# EAGLE design LCDClock (EAGLE 8.1.0)

## Sheet 1 of 2
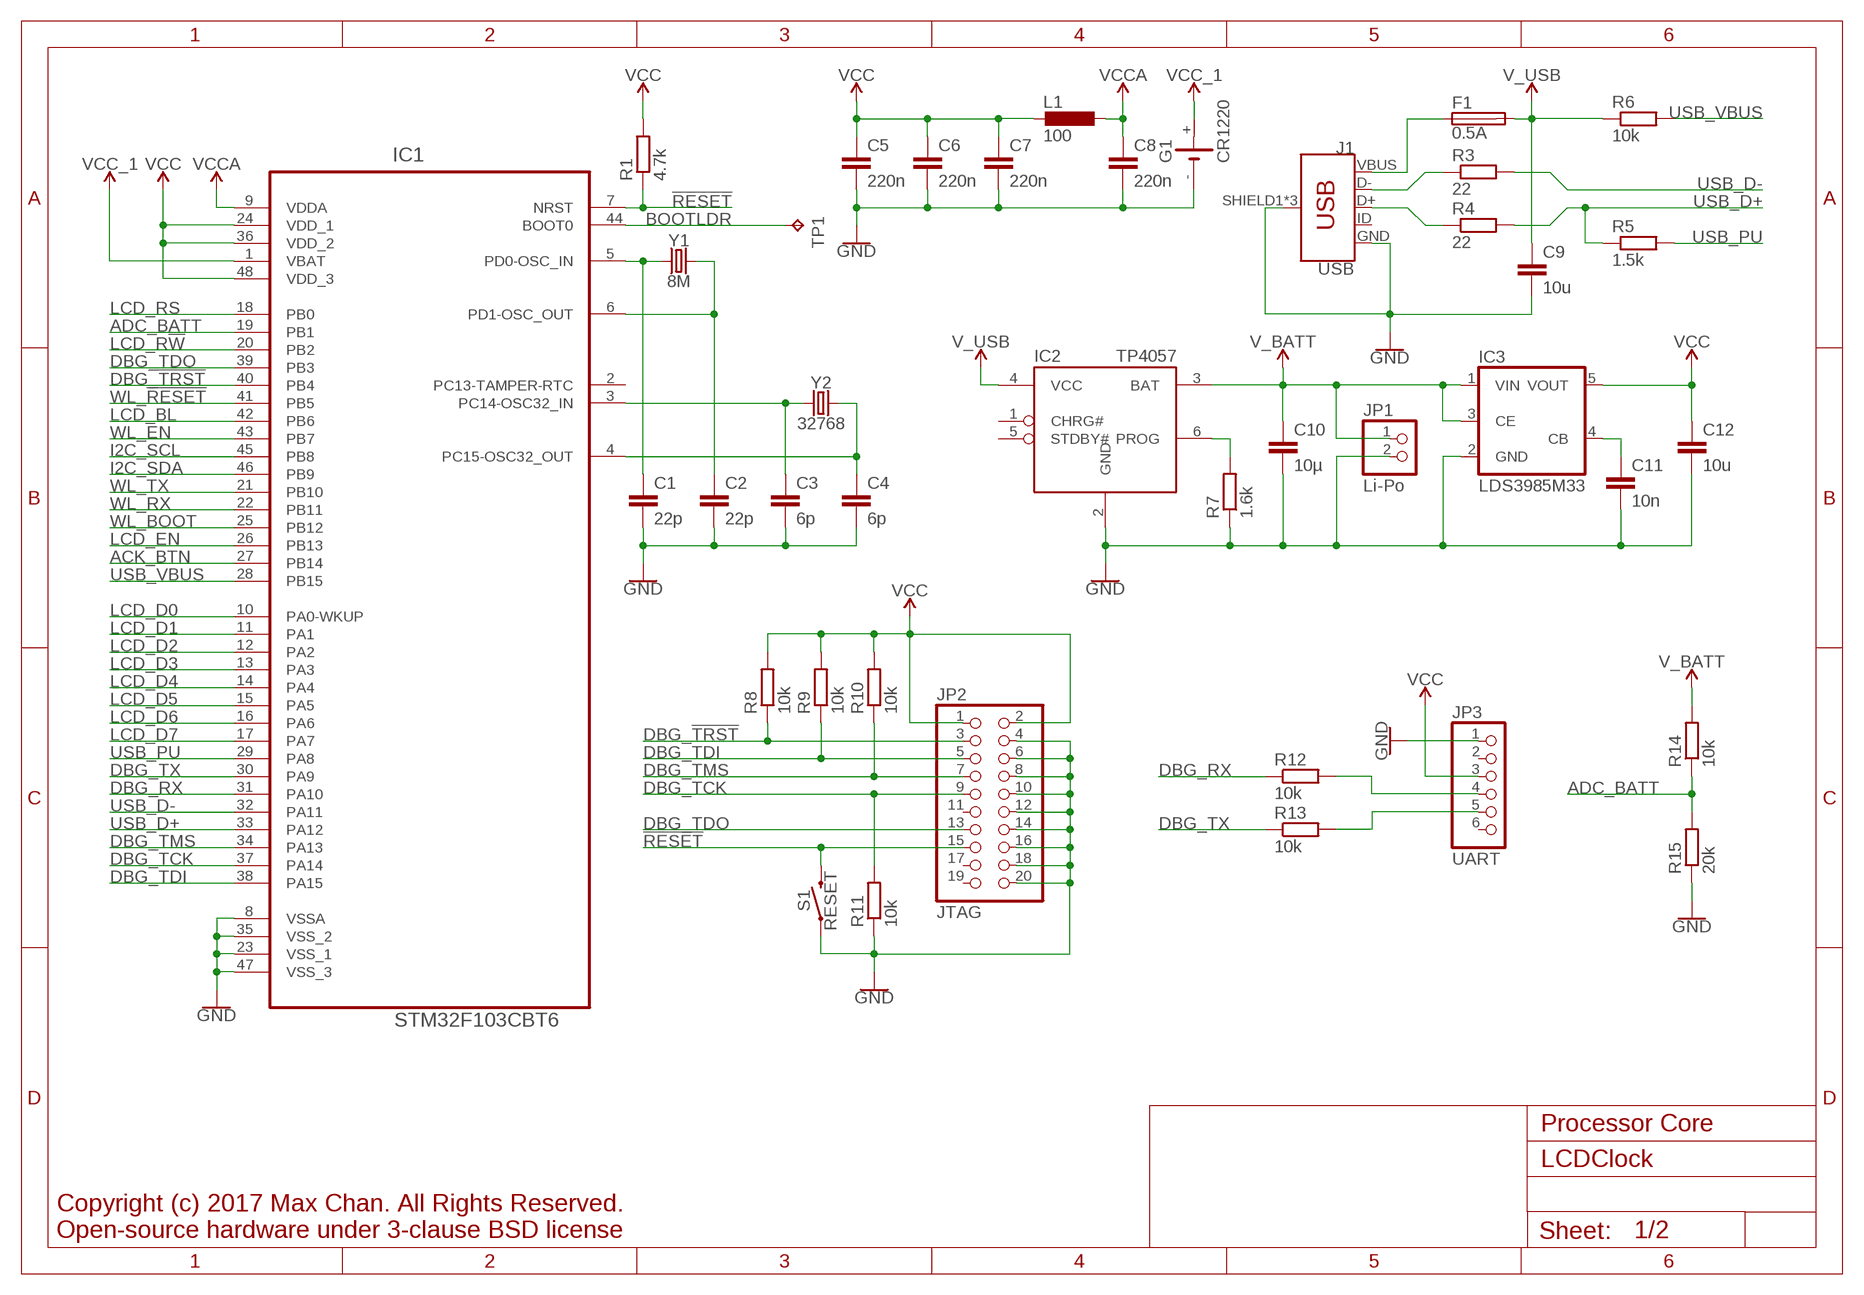
[diagram p0: schematic, sheet 1]

### Parts
C1  22p  C-EUC0603  [C0603]
C2  22p  C-EUC0603  [C0603]
C3  6p  C-EUC0603  [C0603]
C4  6p  C-EUC0603  [C0603]
C5  220n  C-EUC0603  [C0603]
C6  220n  C-EUC0603  [C0603]
C7  220n  C-EUC0603  [C0603]
C8  220n  C-EUC0603  [C0603]
C9  10u  C-EUC0805  [C0805]
C10  10µ  C-EUC0805  [C0805]
C11  10n  C-EUC0603  [C0603]
C12  10u  C-EUC0805  [C0805]
F1  0.5A  FUSER1206  [R1206]
G1  CR1220  CH291-1220LF  [CH291-1220LF]
IC1  STM32F103CBT6  [QFP50P900X900X160-48N]
IC2  TP4057  [SOT23-6]
IC3  LDS3985M33  TS520533  [SOT25]
J1  USB  USB_MICRO-B_FEMALE-SMT  [USB-B-MICRO-SMD]
JP1  Li-Po  PINHD-1X2  [1X02]
JP2  JTAG  PINHD-2X10/90  [2X10/90]
JP3  UART  PINHD-1X6/90  [1X06/90]
L1  100  L-EUL2012C  [L2012C]
R1  4.7k  R-EU_R0603  [R0603]
R3  22  R-EU_R0603  [R0603]
R4  22  R-EU_R0603  [R0603]
R5  1.5k  R-EU_R0603  [R0603]
R6  10k  R-EU_R0603  [R0603]
R7  1.6k  R-EU_R0603  [R0603]
R8  10k  R-EU_R0603  [R0603]
R9  10k  R-EU_R0603  [R0603]
R10  10k  R-EU_R0603  [R0603]
R11  10k  R-EU_R0603  [R0603]
R12  10k  R-EU_R0603  [R0603]
R13  10k  R-EU_R0603  [R0603]
R14  10k  R-EU_R0603  [R0603]
R15  20k  R-EU_R0603  [R0603]
S1  RESET  MOMENTARY-SWITCH-SPST-SMD-6.0X3.5MM  [TACTILE_SWITCH_SMD_6.0X3.5MM]
TP1  TPTP10R  [TP10R]
Y1  8M  CRYSTALSMD-5X3.2-4PAD  [CRYSTAL-SMD-5X3.2-4PAD]
Y2  32768  CRYSTALSMD-3.2X1.5  [CRYSTAL-SMD-3.2X1.5MM]

### Nets
!RESET: IC1.7(NRST) JP2.15 R1.1 S1.2
ACK_BTN: IC1.27(PB14) ; also sheet 2
ADC_BATT: IC1.19(PB1) R14.1 R15.2
BATT_PROG: IC2.6(PROG) R7.2
BOOTLDR: IC1.44(BOOT0) TP1.TP
DBG_!TRST: IC1.40(PB4) JP2.3 R8.1
DBG_RX: IC1.31(PA10) R12.1
DBG_TCK: IC1.37(PA14) JP2.9 R11.2
DBG_TDI: IC1.38(PA15) JP2.5 R9.1
DBG_TDO: IC1.39(PB3) JP2.13
DBG_TMS: IC1.34(PA13) JP2.7 R10.1
DBG_TX: IC1.30(PA9) R13.1
DBGRX: JP3.4 R12.2
DBGTX: JP3.5 R13.2
GND: C1.2 C2.2 C3.2 C4.2 C5.2 C6.2 C7.2 C8.2 C9.2 C10.2 C11.2 C12.2 G1.- IC1.8(VSSA) IC1.23(VSS_1) IC1.35(VSS_2) IC1.47(VSS_3) IC2.2(GND) IC3.2(GND) J1.GND J1.SHIELD1(SHIELD) J1.SHIELD2(SHIELD) J1.SHIELD3(SHIELD) JP1.2 JP2.4 JP2.6 JP2.8 JP2.10 JP2.12 JP2.14 JP2.16 JP2.18 JP2.20 JP3.1 R7.1 R11.1 R15.1 S1.1 ; also sheet 2
HSE_IN: C1.1 IC1.5(PD0-OSC_IN) Y1.1
HSE_OUT: C2.1 IC1.6(PD1-OSC_OUT) Y1.3
I2C_SCL: IC1.45(PB8) ; also sheet 2
I2C_SDA: IC1.46(PB9) ; also sheet 2
LCD_BL: IC1.42(PB6) ; also sheet 2
LCD_D0: IC1.10(PA0-WKUP) ; also sheet 2
LCD_D1: IC1.11(PA1) ; also sheet 2
LCD_D2: IC1.12(PA2) ; also sheet 2
LCD_D3: IC1.13(PA3) ; also sheet 2
LCD_D4: IC1.14(PA4) ; also sheet 2
LCD_D5: IC1.15(PA5) ; also sheet 2
LCD_D6: IC1.16(PA6) ; also sheet 2
LCD_D7: IC1.17(PA7) ; also sheet 2
LCD_EN: IC1.26(PB13) ; also sheet 2
LCD_R!W: IC1.20(PB2) ; also sheet 2
LCD_RS: IC1.18(PB0) ; also sheet 2
LSE_IN: C3.1 IC1.3(PC14-OSC32_IN) Y2.P$1
LSE_OUT: C4.1 IC1.4(PC15-OSC32_OUT) Y2.P$2
UD+: J1.D+ R4.1
UD-: J1.D- R3.1
USB_D+: IC1.33(PA12) R4.2 R5.1
USB_D-: IC1.32(PA11) R3.2
USB_PU: IC1.29(PA8) R5.2
USB_VBUS: IC1.28(PB15) R6.2
V_BATT: C10.1 IC2.3(BAT) IC3.1(VIN) IC3.3(CE) JP1.1 R14.2 ; also sheet 2
V_USB: C9.1 F1.2 IC2.4(VCC) R6.1
VBUS: F1.1 J1.VBUS
VCC: C5.1 C6.1 C7.1 C12.1 IC1.24(VDD_1) IC1.36(VDD_2) IC1.48(VDD_3) IC3.5(VOUT) JP2.1 JP2.2 JP3.3 L1.2 R1.2 R8.2 R9.2 R10.2 ; also sheet 2
VCC_1: G1.+ IC1.1(VBAT)
VCC_FILT: C11.1 IC3.4(CB)
VCCA: C8.1 IC1.9(VDDA) L1.1
WL_!RESET: IC1.41(PB5) ; also sheet 2
WL_BOOT: IC1.25(PB12) ; also sheet 2
WL_EN: IC1.43(PB7) ; also sheet 2
WL_RX: IC1.22(PB11) ; also sheet 2
WL_TX: IC1.21(PB10) ; also sheet 2
Unconnected: IC1.2(PC13-TAMPER-RTC) IC2.1(CHRG#) IC2.5(STDBY#) J1.ID JP2.11 JP2.17 JP2.19 JP3.2 JP3.6

### Notes on the sheet
- Processor Core
- Copyright (c) 2017 Max Chan. All Rights Reserved.
  Open-source hardware under 3-clause BSD license

## Sheet 2 of 2
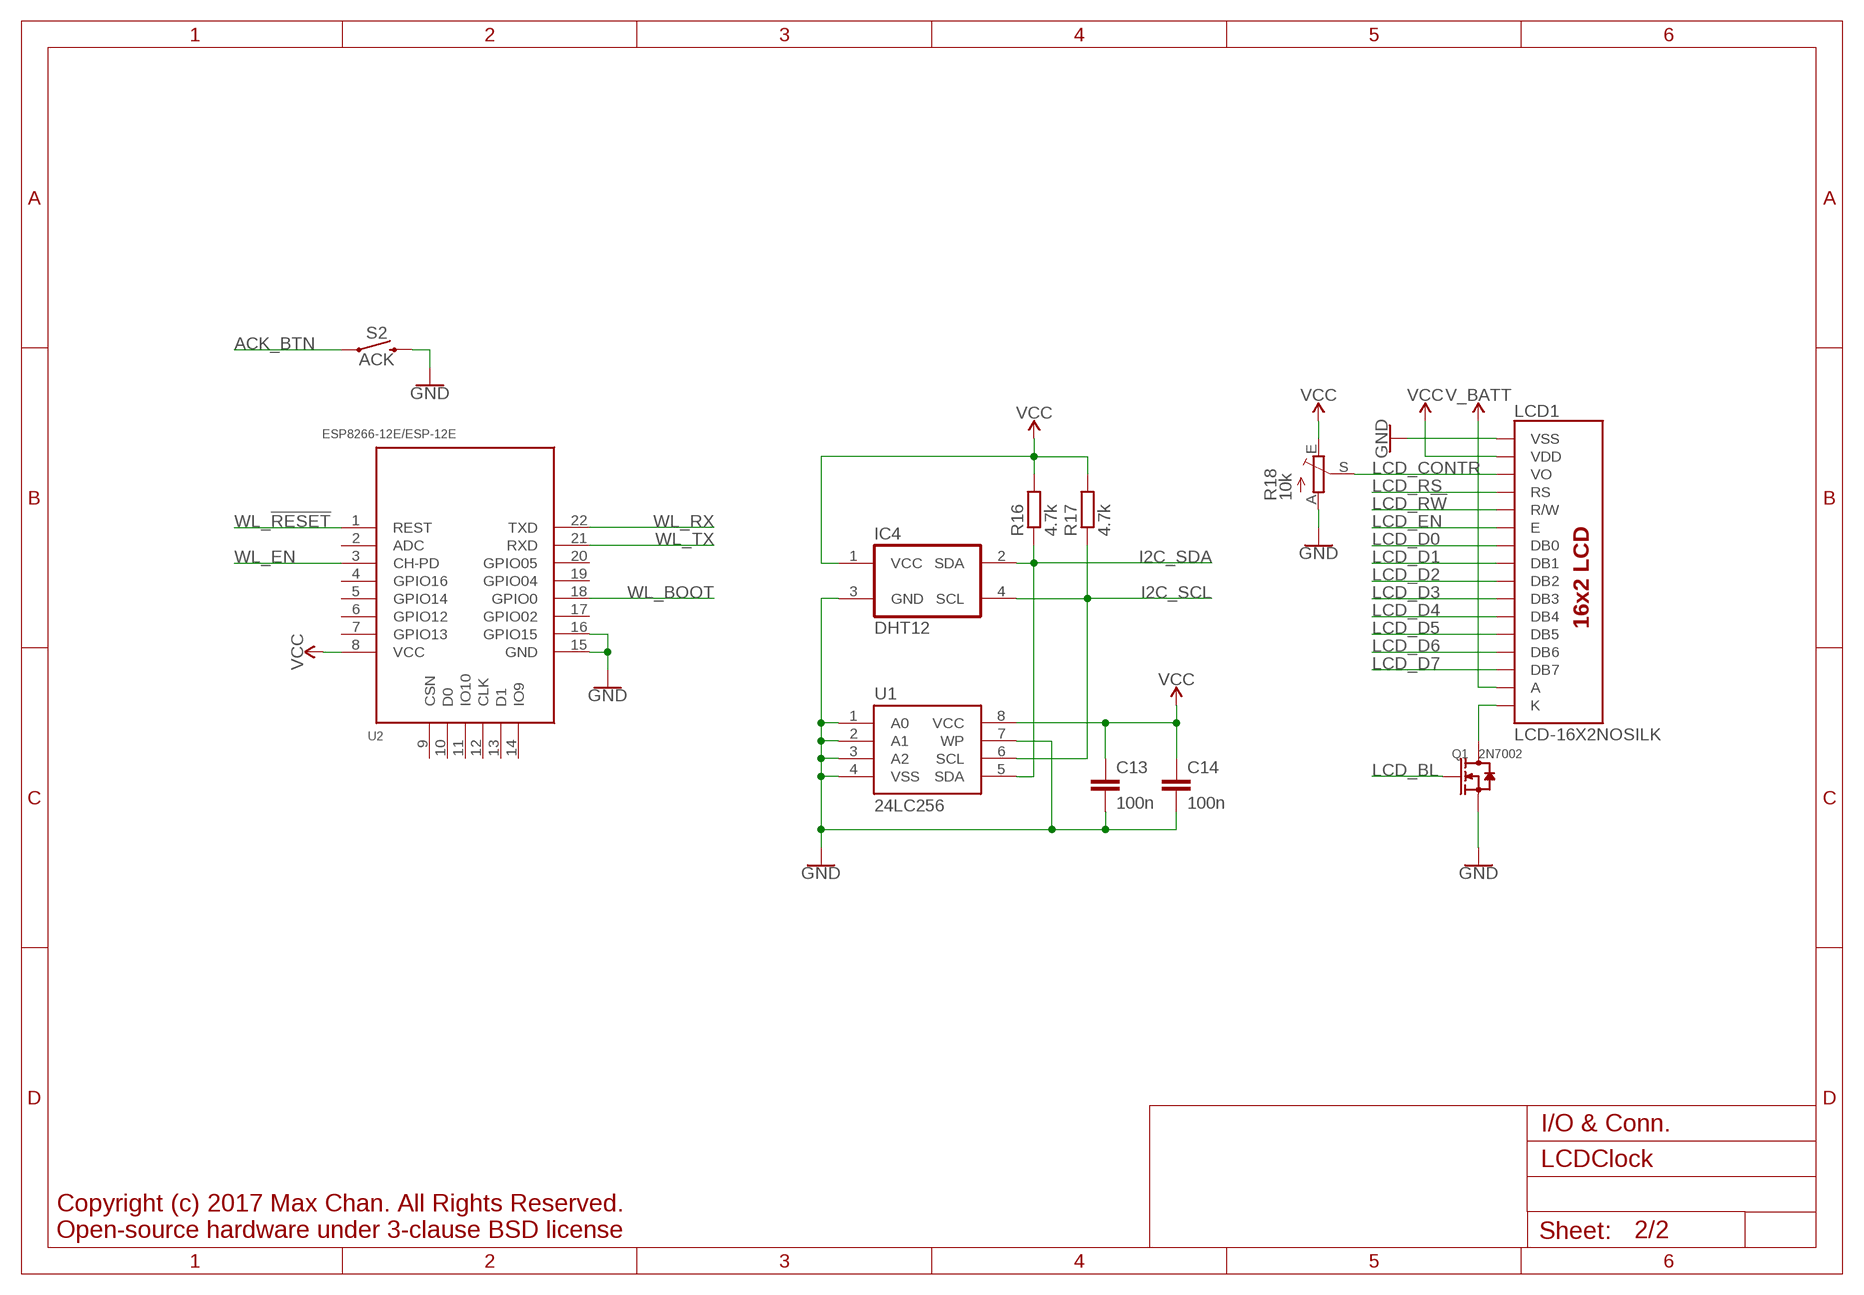
[diagram p1: schematic, sheet 2]

### Parts
C13  100n  C-EUC0603  [C0603]
C14  100n  C-EUC0603  [C0603]
IC4  DHT12  [DHT12]
LCD1  LCD-16X2NOSILK  [LCD-16X2_NOSILK]
Q1  2N7002  SMD-MOSFET-N-CH-60V-300MA-LOGIC-LEVEL-FET-2N7002(SOT-23)  [SOT-23]
R16  4.7k  R-EU_R0603  [R0603]
R17  4.7k  R-EU_R0603  [R0603]
R18  10k  TRIM_EU-CA6V  [CA6V]
S2  ACK  MOMENTARY-SWITCH-SPST-PTH-RIGHT-ANGLE-KIT  [TACTILE_SWITCH_PTH_RIGHT_ANGLE_KIT]
U1  24LC256  EEPROM-I2CSMD  [SO08]
U2  ESP8266-12E/ESP-12E  MOUDLE-WIFI-ESP8266-12E/ESP-12E(22P-24X16MM)  [LGA22-2.0-24X16MM]

### Nets
ACK_BTN: S2.1 ; also sheet 1
GND: C13.2 C14.2 IC4.3(GND) LCD1.1(VSS) Q1.2(S) R18.A S2.2 U1.1(A0) U1.2(A1) U1.3(A2) U1.4(VSS) U1.7(WP) U2.15(GND) U2.16(GPIO15) ; also sheet 1
I2C_SCL: IC4.4(SCL) R17.1 U1.6(SCL) ; also sheet 1
I2C_SDA: IC4.2(SDA) R16.1 U1.5(SDA) ; also sheet 1
LCD_BL: Q1.1(G) ; also sheet 1
LCD_CONTR: LCD1.3(VO) R18.S
LCD_D0: LCD1.7(DB0) ; also sheet 1
LCD_D1: LCD1.8(DB1) ; also sheet 1
LCD_D2: LCD1.9(DB2) ; also sheet 1
LCD_D3: LCD1.10(DB3) ; also sheet 1
LCD_D4: LCD1.11(DB4) ; also sheet 1
LCD_D5: LCD1.12(DB5) ; also sheet 1
LCD_D6: LCD1.13(DB6) ; also sheet 1
LCD_D7: LCD1.14(DB7) ; also sheet 1
LCD_EN: LCD1.6(E) ; also sheet 1
LCD_R!W: LCD1.5(R/W) ; also sheet 1
LCD_RS: LCD1.4(RS) ; also sheet 1
LCDBL: LCD1.16(K) Q1.3(D)
V_BATT: LCD1.15(A) ; also sheet 1
VCC: C13.1 C14.1 IC4.1(VCC) LCD1.2(VDD) R16.2 R17.2 R18.E U1.8(VCC) U2.8(VCC) ; also sheet 1
WL_!RESET: U2.1(REST) ; also sheet 1
WL_BOOT: U2.18(GPIO0) ; also sheet 1
WL_EN: U2.3(CH-PD) ; also sheet 1
WL_RX: U2.22(TXD) ; also sheet 1
WL_TX: U2.21(RXD) ; also sheet 1
Unconnected: U2.2(ADC) U2.4(GPIO16) U2.5(GPIO14) U2.6(GPIO12) U2.7(GPIO13) U2.9(CSN) U2.10(D0) U2.11(IO10) U2.12(CLK) U2.13(D1) U2.14(IO9) U2.17(GPIO02) U2.19(GPIO04) U2.20(GPIO05)

### Notes on the sheet
- I/O & Conn.
- Copyright (c) 2017 Max Chan. All Rights Reserved.
  Open-source hardware under 3-clause BSD license

## Library data of the parts
C1-C14 = rcl:C-EU: CAPACITOR, European symbol
F1 = fuse:FUSE: Fuse
G1 = battery:CH291-1220LF: Battery Holder, SMT, 12mm multicomp PART NO. CH291-1220LF Source: Data sheet <http://www.farnell.com/datasheets/1505860.pdf>
IC1 = ST Microelctronics_By_element14_Batch_1:STM32F103CBT6: Medium-density performance line ARM-based 32-bit MCU; MPN: STM32F103CBT6; OC_FARNELL: 1606327; OC_NEWARK: 11N8296; PACKAGE: QFP-48; SUPPLIER: STMICROELECTRONICS
IC2 = micwl:TP4057
IC3 = v-reg:TS5205: 150mA Low Noise LDO Voltage Regulator with Enable TSC [Taiwan Semiconductor Company, Ltd] Source: http://www.taiwansemi.com .. 5205_0409c.pdf
IC4 = DHT12:DHT12
J1 = SparkFun-Connectors:USB_MICRO-B: USB Type Micro-B Connector Male/female and PTH/SMT variants SparkFun Products: SparkFun microB USB Breakout <https://www.sparkfun.com/products/12035> SparkFun USB microB Plug Breakout <https://www.sparkfun.com/products/10031> SparkFun ESP8266 Thing <https://www.sparkfun.com/products/13231>; PROD_ID: CONN-11752
JP1 = pinhead:PINHD-1X2: PIN HEADER
JP2 = pinhead:PINHD-2X10: PIN HEADER
JP3 = pinhead:PINHD-1X6: PIN HEADER
L1 = rcl:L-EU: INDUCTOR, European symbol
LCD1 = SparkFun-Displays:LCD-16X2: Standard text-only 16x2 parallel input LCD Basic 16 character by 2 line display. Typically utilizes the extremely common HD44780 parallel interface chipset SparkFun Products: Basic 16x2 Green <https://www.sparkfun.com/products/255> Basic 8x2 Green <https://www.sparkfun.com/products/11122>; SF_ID: LCD-00255
Q1 = Seeed-OPL-Transistor:SMD-MOSFET-N-CH-60V-300MA-LOGIC-LEVEL-FET-2N7002(SOT-23): 305030028; MPN: 2N7002,215
R1 R3-R17 = rcl:R-EU_: RESISTOR, European symbol
R18 = pot:TRIM_EU-: POTENTIOMETER
S1 = SparkFun-Switches:MOMENTARY-SWITCH-SPST: Momentary Switch (Pushbutton) - SPST Normally-open (NO) SPST momentary switches (buttons, pushbuttons). Variants PTH-12MM - 12mm square, through-hole Momentary Pushbutton Switch - 12mm Square <https://www.sparkfun.com/products/9190> (COM-09190) PTH-6.0MM, PTH-6.0MM-KIT - 6.0mm square, through-hole Mini Pushbutton Switch <https://www.sparkfun.com/products/97> (COM-00097) KIT package intended for soldering kit's - only one side of pads' copper is exposed. PTH-RIGHT-ANGLE-KIT - Right-angle, through-hole Right Angle Tactile Button <https://www.sparkfun.com/products/10791> - Used on SparkFun BigTime Watch Kit <https://www.sparkfun.com/products/11734> SMD-12MM - 12mm square, surface-mount Tactile Button - SMD (12mm) <https://www.sparkfun.com/products/12993> (COM-12993) Used on SparkFun PicoBoard <https://www.sparkfun.com/products/11888> SMD-4.5MM - 4.5mm Square Trackball Switch Used on SparkFun Blackberry Trackballer Breakout <https://www.sparkfun.com/products/13169> SMD-4.6MMX2.8MM - 4.60mm x 2.80mm, surface mount Used on SparkFun SAMD21 Mini Breakout <https://www.sparkfun.com/products/13664> SMD-5.2MM, SMD-5.2-REDUNDANT - 5.2mm square, surface-mount Mini Pushbutton Switch - SMD <https://www.sparkfun.com/products/8720> (COM-08720) Used on Arduino Pro Mini <https://www.sparkfun.com/products/11114> REDUNDANT package connects both switch circuits together SMD-6.0X3.5MM - 6.0 x 3.5mm, surface mount Momentary Reset Switch SMD <https://www.sparkfun.com/products/8229> (COM-08229) SMD-6.2MM-TALL - 6.2mm square, surface mount Tactile Button - SMD (6mm) <https://www.sparkfun.com/products/12992> Used on SparkFun Digital Sandbox <https://www.sparkfun.com/products/12651> SMD-RIGHT-ANGLE - Right-angle, surface mount Used on SparkFun Block for Intel® Edison - Arduino <https://www.sparkfun.com/products/13036>; PROD_ID: SWCH-00815; SF_SKU: COM-08229
S2 = SparkFun-Switches:MOMENTARY-SWITCH-SPST: Momentary Switch (Pushbutton) - SPST Normally-open (NO) SPST momentary switches (buttons, pushbuttons). Variants PTH-12MM - 12mm square, through-hole Momentary Pushbutton Switch - 12mm Square <https://www.sparkfun.com/products/9190> (COM-09190) PTH-6.0MM, PTH-6.0MM-KIT - 6.0mm square, through-hole Mini Pushbutton Switch <https://www.sparkfun.com/products/97> (COM-00097) KIT package intended for soldering kit's - only one side of pads' copper is exposed. PTH-RIGHT-ANGLE-KIT - Right-angle, through-hole Right Angle Tactile Button <https://www.sparkfun.com/products/10791> - Used on SparkFun BigTime Watch Kit <https://www.sparkfun.com/products/11734> SMD-12MM - 12mm square, surface-mount Tactile Button - SMD (12mm) <https://www.sparkfun.com/products/12993> (COM-12993) Used on SparkFun PicoBoard <https://www.sparkfun.com/products/11888> SMD-4.5MM - 4.5mm Square Trackball Switch Used on SparkFun Blackberry Trackballer Breakout <https://www.sparkfun.com/products/13169> SMD-4.6MMX2.8MM - 4.60mm x 2.80mm, surface mount Used on SparkFun SAMD21 Mini Breakout <https://www.sparkfun.com/products/13664> SMD-5.2MM, SMD-5.2-REDUNDANT - 5.2mm square, surface-mount Mini Pushbutton Switch - SMD <https://www.sparkfun.com/products/8720> (COM-08720) Used on Arduino Pro Mini <https://www.sparkfun.com/products/11114> REDUNDANT package connects both switch circuits together SMD-6.0X3.5MM - 6.0 x 3.5mm, surface mount Momentary Reset Switch SMD <https://www.sparkfun.com/products/8229> (COM-08229) SMD-6.2MM-TALL - 6.2mm square, surface mount Tactile Button - SMD (6mm) <https://www.sparkfun.com/products/12992> Used on SparkFun Digital Sandbox <https://www.sparkfun.com/products/12651> SMD-RIGHT-ANGLE - Right-angle, surface mount Used on SparkFun Block for Intel® Edison - Arduino <https://www.sparkfun.com/products/13036>; PROD_ID: CONN-10672; SF_SKU: COM-10791
TP1 = testpad:TP: Test pad
U1 = SparkFun-IC-Memory:EEPROM-I2C: I2C EEPROMs, 24LC256 and others 24LC256 Series 256 kb I2C 2 Wire (32 k x 8 Bit) 2.5 V Serial EEPROM SMD - SOIC-8 Datasheet SparkFun Products SparkFun UDB5 - PIC UAV Development Board <https://www.sparkfun.com/products/11703> (GPS-11703); PROD_ID: IC-09714
U2 = Seeed-OPL-Moudle:MOUDLE-WIFI-ESP8266-12E/ESP-12E(22P-24X16MM): 317060015; MPN: ESP8266-12E/ESP-12E
Y1 Y2 = SparkFun-Clocks:CRYSTAL: Crystals (Generic) These are passive quartz crystals, which can be used as a clock source for a microcontroller. Crystal's are two-terminal devices. They require external "load" capacitors to generate an oscillating signal.

## Board
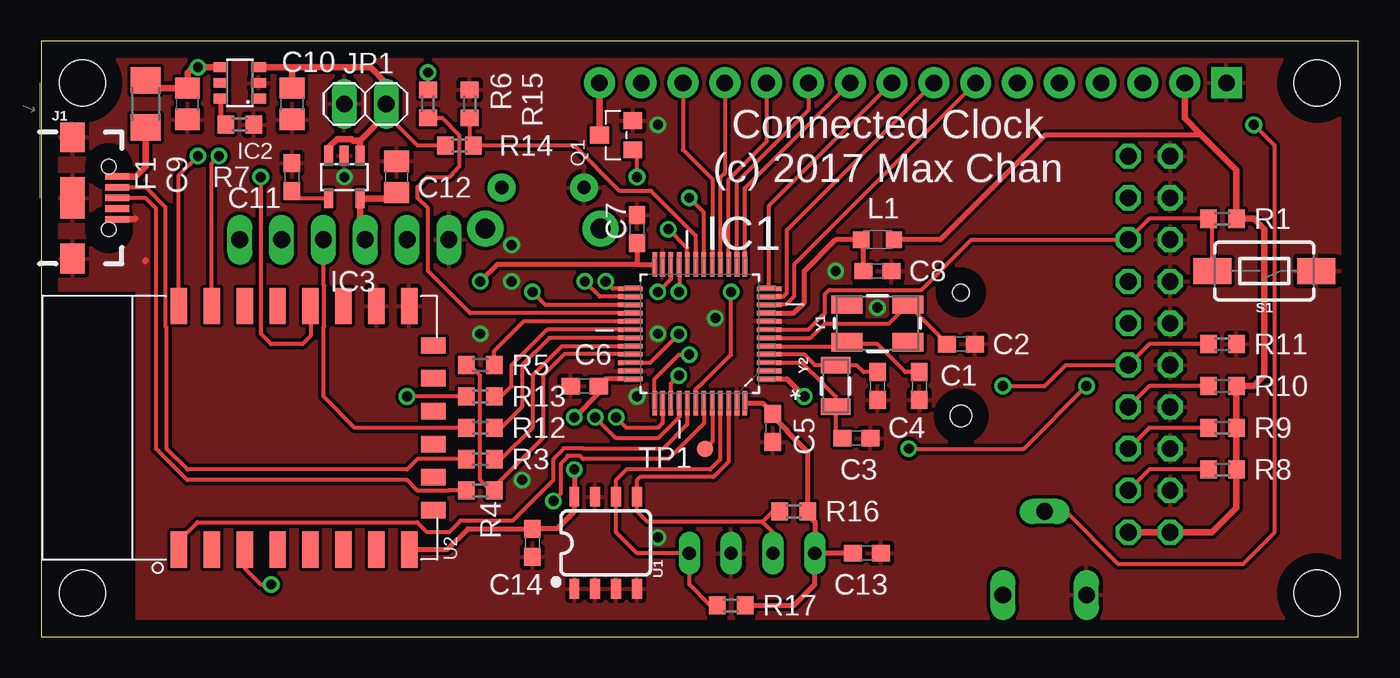
[diagram p2: board, top side]
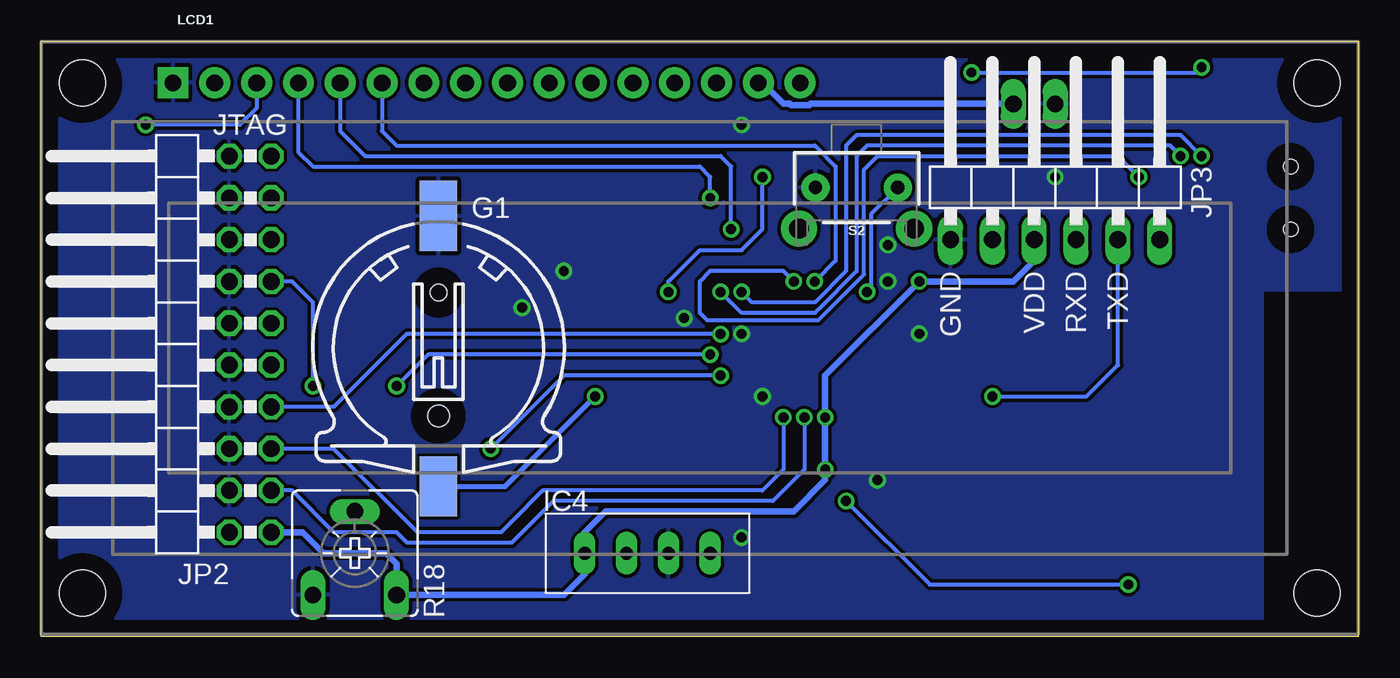
[diagram p3: board, bottom side, seen from below]

Size 80.01 x 36.2 mm. Coordinates in mm from the lower left corner, seen from the top.
Outline: 0,0 80.01,0 80.01,36.2 0,36.2 0,0
Copper layers (1*16): Top 0.035mm / dielectric 1.5mm / Bottom 0.035mm
Design rules "default": minimum track width 10mil, minimum drill 24mil, track to track 8mil, track to pad 8mil, pad to pad 8mil, via to via 8mil, smd to smd 8mil, copper to edge 40mil, drill to drill 8mil, minimum pad ring 10mil, minimum via ring 8mil, stop-mask expansion 4mil, vias tented up to drill 0mil, thermal gap 10mil
tRestrict: area 0,0 to 5.7,21
bRestrict: area 0,0 to 5.7,21
vRestrict: area 0,0 to 5.7,21

### Footprints (pad centres in the part's own frame; a part is rotated, then mirrored left to right if it is on the bottom)
C0603 = smd 1.1 x 1: 1 -0.85,0; 2 0.85,0
C0805 = smd 1.3 x 1.5: 1 -0.95,0; 2 0.95,0
R1206 = smd 1.6 x 1.803: 1 -1.422,0; 2 1.422,0
CH291-1220LF = smd 2.3 x 3.66: + 0,-2.296 | smd 2.3 x 4.3: - 0,14.146 | hole 1.3: 0,2 | hole 1: 0,9.5
QFP50P900X900X160-48N = smd 1.473 x 0.279: 1 -4.216,2.743; 2 -4.216,2.261; 3 -4.216,1.753; 4 -4.216,1.245; 5 -4.216,0.762; 6 -4.216,0.254; 7 -4.216,-0.254; 8 -4.216,-0.762; 9 -4.216,-1.245; 10 -4.216,-1.753; 11 -4.216,-2.261; 12 -4.216,-2.743; 25 4.216,-2.743; 26 4.216,-2.261; 27 4.216,-1.753; 28 4.216,-1.245; 29 4.216,-0.762; 30 4.216,-0.254; 31 4.216,0.254; 32 4.216,0.762; 33 4.216,1.245; 34 4.216,1.753; 35 4.216,2.261; 36 4.216,2.743 | smd 0.279 x 1.473: 13 -2.743,-4.216; 14 -2.261,-4.216; 15 -1.753,-4.216; 16 -1.245,-4.216; 17 -0.762,-4.216; 18 -0.254,-4.216; 19 0.254,-4.216; 20 0.762,-4.216; 21 1.245,-4.216; 22 1.753,-4.216; 23 2.261,-4.216; 24 2.743,-4.216; 37 2.743,4.216; 38 2.261,4.216; 39 1.753,4.216; 40 1.245,4.216; 41 0.762,4.216; 42 0.254,4.216; 43 -0.254,4.216; 44 -0.762,4.216; 45 -1.245,4.216; 46 -1.753,4.216; 47 -2.261,4.216; 48 -2.743,4.216
SOT23-6 = smd 0.6 x 0.9: 1 -0.95,-1.15; 2 0,-1.15; 3 0.95,-1.15; 4 0.95,1.15; 5 0,1.15; 6 -0.95,1.15
SOT25 = smd 0.55 x 1.2: 1 -0.95,-1.3; 2 0,-1.3; 3 0.95,-1.3; 4 0.95,1.3; 5 -0.95,1.3
DHT12 = drill 0.8 long: 1 -3.81,0; 2 -1.27,0; 3 1.27,0; 4 3.81,0
USB-B-MICRO-SMD = smd 1.45 x 0.4: D+ 2.725,0; D- 2.725,0.65; GND 2.725,-1.3; ID 2.725,-0.65; VBUS 2.725,1.3 | smd 1.5 x 1.8: SHIELD1 0,3.685; SHIELD2 0,-3.685 | smd 1.5 x 2.5: SHIELD3 0,0 | hole 0.85: 2.2,1.9; 2.2,-1.9
1X02 = drill 1.016 long: 1 -1.27,0; 2 1.27,0
2X10/90 = drill 1.016 octagon: 1 -11.43,-6.35; 2 -11.43,-3.81; 3 -8.89,-6.35; 4 -8.89,-3.81; 5 -6.35,-6.35; 6 -6.35,-3.81; 7 -3.81,-6.35; 8 -3.81,-3.81; 9 -1.27,-6.35; 10 -1.27,-3.81; 11 1.27,-6.35; 12 1.27,-3.81; 13 3.81,-6.35; 14 3.81,-3.81; 15 6.35,-6.35; 16 6.35,-3.81; 17 8.89,-6.35; 18 8.89,-3.81; 19 11.43,-6.35; 20 11.43,-3.81
1X06/90 = drill 1.016 long: 1 -6.35,-3.81; 2 -3.81,-3.81; 3 -1.27,-3.81; 4 1.27,-3.81; 5 3.81,-3.81; 6 6.35,-3.81
L2012C = smd 1 x 1: 1 -1,0; 2 1,0
LCD-16X2_NOSILK = drill 1.016 pad 1.88 square: 1 -32,15.5 | drill 1.016 pad 1.88: 2 -29.46,15.5; 3 -26.92,15.5; 4 -24.38,15.5; 5 -21.84,15.5; 6 -19.3,15.5; 7 -16.76,15.5; 8 -14.22,15.5; 9 -11.68,15.5; 10 -9.14,15.5; 11 -6.6,15.5; 12 -4.06,15.5; 13 -1.52,15.5; 14 1.02,15.5; 15 3.56,15.5; 16 6.1,15.5 | hole 2.8: -37.5,15.5; -37.5,-15.5; 37.5,15.5; 37.5,-15.5
SOT-23 = smd 1.016 x 1.143: 1 -0.889,-1.016; 2 0.889,-1.016; 3 0,1.016
R0603 = smd 1 x 1.1: 1 -0.85,0; 2 0.85,0
CA6V = drill 1.016 long: A -2.54,-2.54; E 2.54,-2.54; S 0,2.54
TACTILE_SWITCH_SMD_6.0X3.5MM = smd 2.3 x 1.6: 1 -3.15,0; 2 3.15,0
TACTILE_SWITCH_PTH_RIGHT_ANGLE_KIT = drill 0.8 pad 1.7: 1 -2.5,0; 2 2.5,0 | drill 1.2 pad 2.2: ANCHOR1 -3.5,2.5; ANCHOR2 3.5,2.5
TP10R = smd 1 x 1: TP 0,0
SO08 = smd 0.6 x 1.2: 1 -1.905,-2.8; 2 -0.635,-2.8; 3 0.635,-2.8; 4 1.905,-2.8; 5 1.905,2.8; 6 0.635,2.8; 7 -0.635,2.8; 8 -1.905,2.8
LGA22-2.0-24X16MM = smd 2.2 x 1: 1 -7.4,3.7; 2 -7.4,1.7; 3 -7.4,-0.3; 4 -7.4,-2.3; 5 -7.4,-4.3; 6 -7.4,-6.3; 7 -7.4,-8.3; 8 -7.4,-10.3; 15 7.4,-10.3; 16 7.4,-8.3; 17 7.4,-6.3; 18 7.4,-4.3; 19 7.4,-2.3; 20 7.4,-0.3; 21 7.4,1.7; 22 7.4,3.7 | smd 1 x 1.5: 9 -5,-11.75; 10 -3,-11.75; 11 -1,-11.75; 12 1,-11.75; 13 3,-11.75; 14 5,-11.75
CRYSTAL-SMD-5X3.2-4PAD = smd 1.9 x 1.1: 1 -1.85,-1.15; 2 1.85,-1.15; 3 1.85,1.15; 4 -1.85,1.15
CRYSTAL-SMD-3.2X1.5MM = smd 1 x 1.8: P$1 -1.25,0; P$2 1.25,0

### Placement (x,y rotation side)
C1  53.34,15.24 270 top
C2  55.88,17.78 0 top
C3  49.53,12.06 0 top
C4  50.8,15.24 270 top
C5  44.45,12.7 270 top
C6  33.02,15.24 180 top
C7  36.2,24.77 90 top
C8  50.8,22.23 0 top
C9  8.89,32.38 270 top
C10  15.24,32.38 270 top
C11  15.24,27.94 90 top
C12  21.59,27.94 90 top
C13  50.16,5.08 0 top
C14  29.84,5.71 270 top
F1  6.35,32.38 90 top
G1  55.88,11.43 0 bottom
IC1  40.01,18.41 180 top
IC2  12.06,33.66 90 top
IC3  18.41,27.94 180 top
IC4  43.18,5.08 0 bottom
J1  1.91,26.67 0 top
JP1  19.68,32.38 180 top
JP2  72.39,17.78 90 bottom
JP3  18.41,27.94 0 bottom
L1  50.8,24.13 0 top
LCD1  40.01,18.16 0 bottom
Q1  34.92,30.48 90 top
R1  71.75,25.4 0 top
R3  26.67,10.79 0 top
R4  26.67,8.89 0 top
R5  26.67,16.51 0 top
R6  23.5,32.38 270 top
R7  12.06,31.11 180 top
R8  71.75,10.16 0 top
R9  71.75,12.7 0 top
R10  71.75,15.24 0 top
R11  71.75,17.78 180 top
R12  26.67,12.7 180 top
R13  26.67,14.61 180 top
R14  25.4,29.84 180 top
R15  26.04,32.38 270 top
R16  45.72,7.62 0 top
R17  41.91,1.91 0 top
R18  60.96,5.08 0 bottom
S1  74.3,22.23 180 top
S2  30.48,27.3 180 bottom
TP1  40.32,11.43 0 top
U1  34.29,5.71 0 top
U2  12.06,12.7 90 top
Y1  50.8,19.05 0 top
Y2  48.26,15.24 90 top

### Tracks (layer width: path | path; a pad name or v marks a point on that pad's centre or on a via)
!RESET
  Top 0.254: S1.2 71.14,25.16 R1.1 67.31,25.4 JP2.15 56.52,24.13 53.47,21.08 47.86,21.08 47.62,20.84 47.62,19.68 47.45,19.51 47.44,19.51 46.6,18.67 IC1.7
ACK_BTN  (via drill 0.6)
  Top 0.254: IC1.27 30.63,20.17 v29.84,20.95
  Bottom 0.254: v29.84,20.95 29.84,20.92 29.57,21.2 29.57,25.72 S2.1
ADC_BATT
  Top 0.254: IC1.19 39.75,24.38 37.05,27.09 35.14,27.09 32.38,29.84 R14.1 26.04,30.06 R15.2
BATT_PROG
  Top 0.305: IC2.6 10.91,31.41 R7.2
BOOTLDR
  Top 0.254: IC1.44 40.77,11.87 TP1.TP
DBG_!TRST  (via drill 0.6)
  Top 0.254: R8.1 67.31,10.16 JP2.3 | IC1.40 38.76,13.36 37.47,12.06 34.92,12.06 v33.66,13.34
  Bottom 0.254: v33.66,13.34 33.66,10.16 35.56,8.26 48.9,8.26 51.44,5.71 57.78,5.71 58.42,6.35 62.23,6.35 64.77,8.89 JP2.3
DBG_RX
  Top 0.254: R12.1 27.94,12.7 29.21,13.97 29.21,15.88 29.22,15.88 29.22,16.5 30.87,18.16 IC1.31
DBG_TCK  (via drill 0.6)
  Top 0.254: R11.2 67.31,17.78 JP2.9 62.23,16.51 60.96,15.24 v58.42,15.24 | v39.37,17.14 38.73,17.14 37.26,15.67 IC1.37
  Bottom 0.254: v39.37,17.14 56.52,17.14 v58.42,15.24
DBG_TDI  (via drill 0.6)
  Top 0.254: R9.1 67.31,12.7 JP2.5 | IC1.38 37.74,12.99 37.46,12.71 35.55,12.71 v34.92,13.34
  Bottom 0.254: v34.92,13.34 34.92,10.16 36.2,8.89 49.54,8.89 51.44,6.99 51.44,6.98 52.07,6.35 57.15,6.35 62.23,11.43 JP2.5
DBG_TDO  (via drill 0.6)
  Top 0.254: IC1.39 38.25,15.39 v38.73,15.88 | v52.7,11.43 59.69,11.43 v63.5,15.24
  Bottom 0.254: v38.73,15.88 48.26,15.88 v52.7,11.43 | v63.5,15.24 63.5,20.32 64.77,21.59 JP2.13
DBG_TMS  (via drill 0.6)
  Top 0.254: R10.1 67.31,15.24 JP2.7 | IC1.34 37,16.66 v38.73,18.39
  Bottom 0.254: v38.73,18.39 57.81,18.39 62.23,13.97 JP2.7
DBG_TX
  Top 0.254: IC1.30 30.73,18.67 28.57,16.51 28.57,15.24 27.94,14.61 R13.1
DBGRX
  Top 0.254: R12.2 19.05,12.7 17.14,14.61 17.14,18.81 17.2,18.86 17.2,21.34 17.14,21.39 JP3.4
DBGTX  (via drill 0.6)
  Top 0.254: R13.2 v22.23,14.61
  Bottom 0.254: v22.23,14.61 16.51,14.61 14.61,16.51 JP3.5
GND  (via drill 0.6)
  Top 0.406: 6.32,22.83 6.35,22.86 | J1.GND 5.68,25.37 5.71,25.4
  other vias: 48.26,22.23 18.41,27.94 36.2,14.61 37.47,6.03 29.21,9.53 37.47,31.11 28.57,21.59 40.96,19.37 37.47,18.41 26.67,18.41 28.57,23.81 50.8,20
  pour Bottom: 0,0 80.01,0 80.01,36.2 0,36.2
  pour Top: 0,0 80.01,0 80.01,36.2 0,36.2
HSE_IN
  Top 0.254: IC1.5 48.95,17.65 Y1.1 49.07,17.78 50.8,17.78 52.49,16.09 C1.1
HSE_OUT
  Top 0.254: IC1.6 46.74,18.16 47.62,19.05 51.5,19.05 Y1.3 55.03,17.82 C2.1
I2C_SCL
  Top 0.254: IC1.45 41.25,10.77 40.64,10.16 35.56,10.16 34.92,9.53 U1.6 34.92,6.35 36.2,5.08 IC4.4 39.37,3.17 40.64,1.91 R17.1
I2C_SDA
  Top 0.254: IC1.46 41.76,10.63 40.83,9.7 36.37,9.7 36.2,9.53 U1.5 36.2,7.62 36.83,6.99 43.81,6.99 | IC4.2 44.45,6.35 43.81,6.99 | R16.1 44.45,7.62 43.81,6.99
LCD_BL  (via drill 0.6)
  Top 0.254: IC1.42 39.75,15.03 39.98,15.27 40.03,15.27 41.91,17.14 v41.91,20.95 | v36.2,27.94 36.2,29.34 Q1.1
  Bottom 0.254: v41.91,20.95 41.91,21.59 40.01,23.5 37.47,23.5 36.2,24.77 v36.2,27.94
LCD_CONTR  (via drill 0.6)
  Top 0.254: R18.S 62.23,7.62 65.41,4.45 73.03,4.45 74.93,6.35 74.93,29.84 v73.66,31.11
  Bottom 0.254: v73.66,31.11 67.94,31.11 66.92,32.13 LCD1.3
LCD_D0
  Top 0.254: LCD1.7 45.74,22.64 45.74,20.69 45.26,20.21 44.26,20.21 IC1.10
LCD_D1
  Top 0.254: IC1.11 44.23,20.69 45.09,20.69 45.29,20.88 45.29,24.72 LCD1.8
LCD_D2
  Top 0.254: IC1.12 44.22,26.2 LCD1.9
LCD_D3
  Top 0.254: IC1.13 42.75,27.26 LCD1.10
LCD_D4
  Top 0.254: IC1.14 42.27,27.64 44.52,29.89 44.52,29.92 46.6,32 LCD1.11
LCD_D5
  Top 0.254: IC1.15 41.76,27.78 41.98,28 41.98,28.01 44.06,30.09 LCD1.12
LCD_D6
  Top 0.254: 41.25,27.91 IC1.16 | 41.25,27.91 41.27,27.94 | LCD1.13 41.52,28.19 41.25,27.91
LCD_D7
  Top 0.254: IC1.17 40.77,27.81 38.98,29.59 LCD1.14
LCD_EN  (via drill 0.6)
  Top 0.254: IC1.26 33.93,20.68 v33.02,21.59
  Bottom 0.254: LCD1.6 59.3,30.73 58.42,29.84 33.02,29.84 31.75,28.57 31.75,22.86 v33.02,21.59
LCD_R!W  (via drill 0.6)
  Top 0.254: IC1.20 39.24,23.62 v38.1,24.77
  Bottom 0.254: v38.1,24.77 38.1,28.57 38.73,29.21 60.33,29.21 61.84,30.73 LCD1.5
LCD_RS  (via drill 0.6)
  Top 0.254: IC1.18 40.26,25.78 v39.37,26.67
  Bottom 0.254: v39.37,26.67 39.37,27.94 40.01,28.57 63.5,28.57 64.39,29.46 LCD1.4
LCDBL
  Top 0.406: Q1.3 LCD1.16
LSE_IN
  Top 0.254: IC1.3 46.19,16.66 46.8,16.05 46.81,16.05 48.26,14.61 Y2.P$1 48.26,12.48 C3.1
LSE_OUT
  Top 0.254: IC1.4 46.33,17.17 46.99,16.51 48.24,16.51 Y2.P$2 49.55,16.49 49.95,16.09 C4.1
UD+
  Top 0.254: R4.1 24.72,8.89 24.7,8.87 22.88,8.87 22.23,9.53 8.88,9.53 7.16,11.24 7.16,11.25 6.99,11.43 6.99,26.02 6.34,26.66 J1.D+
UD-
  Top 0.254: R3.1 22.86,10.79 22.23,10.16 8.89,10.16 7.62,11.43 7.62,18.78 7.54,18.86 7.54,26.12 6.33,27.32 J1.D-
USB_D+
  Top 0.254: IC1.33 31.79,17.17 30.49,15.87 30.49,12.07 27.3,8.89 | R5.1 26.04,16.51 26.67,15.88 26.67,9.53 27.3,8.89 | R4.2 27.3,8.89
USB_D-
  Top 0.254: IC1.32 31.62,17.65 29.84,15.88 29.84,12.7 27.94,10.79 R3.2
USB_PU
  Top 0.254: IC1.29 29.34,19.18 27.52,17.36 R5.2
USB_VBUS
  Top 0.254: IC1.28 26.06,19.66 23.5,22.23 23.5,26.04 22.86,26.67 22.86,27.34 23.44,27.92 23.48,27.92 23.5,27.94 24.8,27.94 25.01,28.15 25.01,28.18 25.4,28.57 25.4,30.48 24.34,31.54 R6.2
V_BATT
  Top 0.254: R14.2 22.86,29.84 20.95,31.75
  Top 0.406: 15.24,34.6 IC2.3 | 15.24,34.6 20,34.6 20.95,33.66 JP1.1 20.95,31.75 19.36,30.16 | IC3.1 19.36,30.16 | C10.1 15.24,34.6 | 19.36,30.16 18.95,30.16 18.86,30.25 17.97,30.25 17.46,29.74 IC3.3
  Bottom 0.406: LCD1.15 36.2,33.66 34.92,32.38 34.53,32.38 34.46,32.31 33.35,32.31 33.28,32.38 JP1.1
V_USB  (via drill 0.6)
  Top 0.254: R6.1 v23.5,34.29
  Top 0.406: F1.2 6.82,33.34 C9.1 8.89,34.29 9.21,34.6 v9.53,34.6 IC2.4
  Bottom 0.254: v23.5,34.29 9.84,34.29 v9.53,34.6
VBUS
  Top 0.406: J1.VBUS 5.75,27.97 6.35,28.57 F1.1
VCC  (via drill 0.6)
  Top 0.305: R17.2 45.72,1.91 46.99,3.17 IC4.1 | IC4.1 46.99,6.99 46.57,7.41 R16.2 46.57,11.21 45.31,12.48 45.31,12.55 44.45,13.4 C5.1 43.8,14.2 IC1.48 | v32.38,10.16 U1.8 32.38,7.62 31.33,6.57 C14.1 25.93,6.57 24.67,5.3 U2.8 | 36.2,22.63 IC1.24 | 36.2,22.63 27.71,22.63 v26.67,21.59 | C7.1 36.2,22.63 | C13.1 IC4.1 | L1.2 54.61,24.13 60.96,30.48 70.48,30.48 | v32.38,13.34 33.87,14.82 C6.1 34.3,15.67 IC1.36
  Top 0.406: C12.1 21.24,26.64 IC3.5 19.36,25.09 19.68,24.77 JP3.3 | JP2.1 JP2.2 71.12,6.35 72.61,7.83 R8.2 R9.2 R10.2 73.66,15.24 74.3,15.88 74.3,24.77 73.66,25.4 R1.2 72.61,28.36 70.48,30.48 69.47,31.5 LCD1.2
  Bottom 0.406: JP3.3 19.68,22.86 20.95,21.59 v26.67,21.59 32.38,15.88 v32.38,13.34 v32.38,10.16 32.38,9.53 34.29,7.62 45.72,7.62 46.99,6.35 IC4.1 46.99,3.81 48.26,2.54 R18.E 58.42,4.45 59.05,5.08 62.87,5.08 64.14,6.35 JP2.1
VCC_1  (via drill 0.6)
  Top 0.305: IC1.1 45.29,15.67 v46.35,14.61
  Bottom 0.305: G1.+ 51.83,9.13 v46.35,14.61
VCC_FILT
  Top 0.254: IC3.4 15.69,26.64 C11.1
VCCA
  Top 0.305: IC1.9 45.7,19.66 46.35,20.32 46.35,22.23 48.26,24.13 L1.1 49.95,23.98 C8.1
WL_!RESET
  Top 0.254: IC1.41 39.24,12.89 37.78,11.43 32.94,11.43 32.92,11.45 31.76,11.45 31.09,10.79 31.09,9.5 28.64,7.05 25.46,7.05 24.77,6.35 23.45,6.35 22.84,6.96 9.5,6.96 8.37,5.83 U2.1
WL_BOOT  (via drill 0.6)
  Top 0.254: IC1.25 34.72,21.16 v34.29,21.59 | v13.34,27.94 13.34,18.41 13.97,17.78 15.88,17.78 16.36,18.27 U2.18
  Bottom 0.254: v34.29,21.59 34.92,22.23 39.37,22.23 40.01,21.59 40.01,19.68 39.55,19.23 32.82,19.23 30.02,22.02 30.02,28.4 29.21,29.21 14.61,29.21 v13.34,27.94
WL_EN  (via drill 0.6)
  Top 0.254: IC1.43 40.26,12.95 38.1,10.79 32.93,10.79 32.73,10.99 31.95,10.99 31.95,10.9 31.55,10.51 31.55,8.69 v31.11,8.26 | U2.3 12.37,4.14 13.34,3.17 v13.97,3.17
  Bottom 0.254: v31.11,8.26 26.04,3.17 v13.97,3.17
WL_RX  (via drill 0.6)
  Top 0.254: U2.22 8.37,28.05 v9.53,29.21 | IC1.22 38.25,21.74 v37.47,20.95
  Bottom 0.254: v9.53,29.21 10.79,30.48 30.48,30.48 31.11,29.84 31.11,22.23 33.02,20.32 36.83,20.32 v37.47,20.95
WL_TX  (via drill 0.6)
  Top 0.254: U2.21 10.37,28.78 v10.79,29.21 | IC1.21 38.76,20.98 v38.73,20.95
  Bottom 0.254: v10.79,29.21 11.43,29.84 29.84,29.84 30.48,29.21 30.48,22.21 32.83,19.86 32.84,19.86 33.02,19.68 37.47,19.68 v38.73,20.95

### Text on the board
tPlace: Connected Clock / (c) 2017 Max Chan
bPlace: JTAG | TXD | RXD | VDD | GND